# Altium schematic sheet SCH_ESP32_8051_GATE.SchDoc
size 381 x 241 mm; SheetNumber: 1; SheetTotal: 1
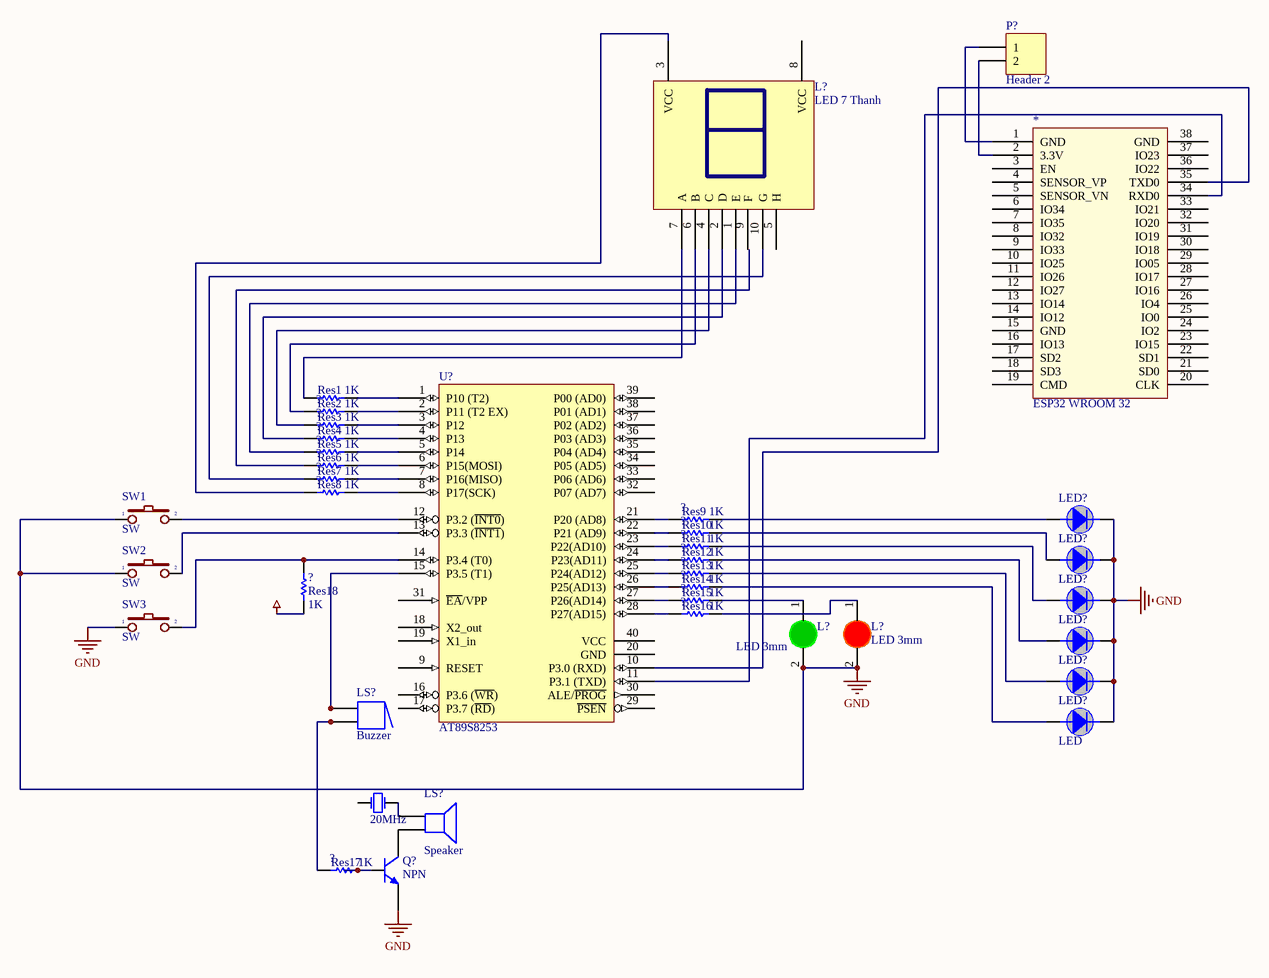
[diagram p0: SCH_ESP32_8051_GATE.SchDoc]

## Parts
(Parts that share a designator on the sheet are numbered #1, #2 ... from top to bottom, then left to right.)
*  ESP32 WROOM 32  [ESP32-WROOM-32D]
?#1  Res1  value 1K  [AXIAL-0.3]
?#2  Res2  value 1K  [AXIAL-0.3]
?#3  Res3  value 1K  [AXIAL-0.3]
?#4  Res4  value 1K  [AXIAL-0.3]
?#5  Res5  value 1K  [AXIAL-0.3]
?#6  Res6  value 1K  [AXIAL-0.3]
?#7  Res7  value 1K  [AXIAL-0.3]
?#8  Res8  value 1K  [AXIAL-0.3]
?#9  Res9  value 1K  [AXIAL-0.3]
?#10  Res10  value 1K  [AXIAL-0.3]
?#11  Res11  value 1K  [AXIAL-0.3]
?#12  Res12  value 1K  [AXIAL-0.3]
?#13  Res13  value 1K  [AXIAL-0.3]
?#14  Res14  value 1K  [AXIAL-0.3]
?#15  Res15  value 1K  [AXIAL-0.3]
?#16  Res18  value 1K  [AXIAL-0.3]
?#17  Res16  value 1K  [AXIAL-0.3]
?#18  Res17  value 1K  [AXIAL-0.3]
L?#1  LED 7 Thanh  [LED 7x1 0.56]
L?#2  LED 3mm  [LED-3MM-GREEN]
L?#3  LED 3mm  [LED-3MM-RED]
LED?#1  LED  [LED_phi 5]
LED?#2  LED  [LED_phi 5]
LED?#3  LED  [LED_phi 5]
LED?#4  LED  [LED_phi 5]
LED?#5  LED  [LED_phi 5]
LED?#6  LED  [LED_phi 5]
LS?#1  Buzzer  [ABSM-1574]
LS?#2  Speaker  [PIN2]
P?  Header 2  [HDR1X2]
Q?  NPN  [TO-226-AA]
SW1  SW  [SW-2P-S]
SW2  SW  [SW-2P-S]
SW3  SW  [SW-2P-S]
U?  AT89S8253  [DIP40_]
Y?  20MHz  [XTAL]

## Nets
GND: L?#2.2(K) L?#3.2(K) LED?#1.2(Katot) LED?#2.2(Katot) LED?#3.2(Katot) LED?#4.2(Katot) LED?#5.2(Katot) LED?#6.2(Katot) Q?.3(E) SW1.1 SW2.1 SW3.1
Net*_1: *.1(GND) P?.1
Net*_2: *.2(3.3V) P?.2
Net*_34: *.34(RXD0) U?.11(P3.1_(TXD))
Net*_35: *.35(TXD0) U?.10(P3.0_(RXD))
Net?#1_1: ?#1.1 L?#1.7(A)
Net?#1_2: ?#1.2 U?.1(P10_(T2))
Net?#2_1: ?#2.1 L?#1.6(B)
Net?#2_2: ?#2.2 U?.2(P11_(T2_EX))
Net?#3_1: ?#3.1 L?#1.4(C)
Net?#3_2: ?#3.2 U?.3(P12)
Net?#4_1: ?#4.1 L?#1.2(D)
Net?#4_2: ?#4.2 U?.4(P13)
Net?#5_1: ?#5.1 L?#1.1(E)
Net?#5_2: ?#5.2 U?.5(P14)
Net?#6_2: ?#6.2 U?.6(P15(MOSI))
Net?#7_1: ?#7.1 L?#1.10(G)
Net?#7_2: ?#7.2 U?.7(P16(MISO))
Net?#8_1: ?#8.1 L?#1.3(VCC)
Net?#8_2: ?#8.2 U?.8(P17(SCK))
Net?#9_1: ?#9.1 U?.21(P20_(AD8))
Net?#9_2: ?#9.2 LED?#1.1(anot)
Net?#10_1: ?#10.1 U?.22(P21_(AD9))
Net?#10_2: ?#10.2 LED?#2.1(anot)
Net?#11_1: ?#11.1 U?.23(P22(AD10))
Net?#11_2: ?#11.2 LED?#3.1(anot)
Net?#12_1: ?#12.1 U?.24(P23(AD11))
Net?#12_2: ?#12.2 LED?#4.1(anot)
Net?#13_1: ?#13.1 U?.25(P24(AD12))
Net?#13_2: ?#13.2 LED?#5.1(anot)
Net?#14_1: ?#14.1 U?.26(P25(AD13))
Net?#14_2: ?#14.2 LED?#6.1(anot)
Net?#15_1: ?#15.1 U?.27(P26(AD14))
Net?#15_2: ?#15.2 L?#2.1(A)
Net?#16_2: ?#16.2 SW3.2 U?.14(P3.4_(T0))
Net?#17_1: ?#17.1 U?.28(P27(AD15))
Net?#17_2: ?#17.2 L?#3.1(A)
Net?#18_1: ?#18.1 LS?#1.2 LS?#1.2A
Net?#18_2: ?#18.2 Q?.2(B)
NetLS?#1_1: LS?#1.1 LS?#1.1A U?.15(P3.5_(T1))
NetLS?#2_1: LS?#2.1 Y?.2(OSC2)
NetLS?#2_2: LS?#2.2 Q?.1(C)
NetSW1_2: SW1.2 U?.12(P3.2_(~{INT0}))
NetSW2_2: SW2.2 U?.13(P3.3_(~{INT1}))

Not connected (* = marked no-connect by the designer): * 3(EN) 4(SENSOR_VP) 5(SENSOR_VN) 6(IO34) 7(IO35) 8(IO32) 9(IO33) 10(IO25) 11(IO26) 12(IO27) 13(IO14) 14(IO12) 15(GND) 16(IO13) 17(SD2) 18(SD3) 19(CMD) 20(CLK) 21(SD0) 22(SD1) 23(IO15) 24(IO2) 25(IO0) 26(IO4) 27(IO16) 28(IO17) 29(IO05) 30(IO18) 31(IO19) 32(IO20) 33(IO21) 36(IO22) 37(IO23) 38(GND); ?#6 1; ?#16 1; L?#1 5(H) 8(VCC) 9(F); U? 9(RESET) 16(P3.6_(~{WR})) 17(P3.7_(~{RD})) 18(X2_out) 19(X1_in) 20(GND) 29(~{PSEN}) 30(ALE/~{PROG}) 31(~{EA}/VPP) 32(P07_(AD7)) 33(P06_(AD6)) 34(P05_(AD5)) 35(P04_(AD4)) 36(P03_(AD3)) 37(P02_(AD2)) 38(P01_(AD1)) 39(P00_(AD0)) 40(VCC); Y? 1(OSC1)

## Library data of the parts
?#1-?#18 = Res1: Resistor; Published: 8-Jun-2000; LatestRevisionDate: 17-Jul-2002; LatestRevisionNote: Re-released for DXP Platform.; PackageReference: AXIAL-0.3; Publisher: Altium Limited; PackageDescription: Axial Device, Thru-Hole; 2 Leads; 0.3 in Pin Spacing
L?#1 = LED 7x1 0.56 Anot: Dán; Don_Vi: Con; Ma_Hang: MH000834; Ten_Linh_Kien: Led 7 0.56 1 Số Anot (Sáng Đỏ); Ghi_Chu: *; Kieu_Chan: *; Chung_Loai: Dán
L?#2 = LED 3mm Xanh La: Cắm; Don_Vi: Con; Ma_Hang: MH001054; Ten_Linh_Kien: Led 3MM Phủ Xanh (10c); Ghi_Chu: *; Kieu_Chan: *; Chung_Loai: Cắm
L?#3 = LED 3mm Do: Cắm; Don_Vi: Con; Ma_Hang: MH003892; Ten_Linh_Kien: Led 3MM Phủ Đỏ (10c); Ghi_Chu: *; Kieu_Chan: *; Chung_Loai: Cắm
LED?#1-LED?#6 = LED_phi 5
LS?#1 = Buzzer: Magnetic Transducer Buzzer; Published: 24-Mar-1999; LatestRevisionDate: 17-Dec-2003; LatestRevisionNote: Schematic revised, PCB Footprint replaced.; DatasheetVersion: 17-Dec-2003; PackageReference: ABSM-1574; Publisher: Altium Limited; PackageDescription: Magnetic Transducer Buzzer; ComponentLink1Description: Manufacturer Link; ComponentLink1URL: http://www.megastar.com/linecard/buzzmode/index.php
LS?#2 = Speaker: Loudspeaker; Published: 24-Mar-1999; LatestRevisionDate: 17-Jul-2002; LatestRevisionNote: Re-released for DXP Platform.; PackageReference: PIN2; Publisher: Altium Limited
P? = Header 2: Header, 2-Pin; LatestRevisionDate: 17-Jul-2002; LatestRevisionNote: Re-released for DXP Platform.; Publisher: Altium Limited
Q? = NPN: NPN Bipolar Transistor; Published: 8-Jun-2000; LatestRevisionDate: 17-Jul-2002; LatestRevisionNote: Re-released for DXP Platform.; PackageReference: TO-226-AA; Publisher: Altium Limited; PackageDescription: TO, Flat Index; 3 In-Line, Axial Leads; Body Dia. 4.8mm; Leads 0.55 x 0.51 mm (max); Code_JEDEC: TO-226-AA
SW1-SW3 = SW2: Switch button 2 pin; Value: SW chip 2 pin
Y? = XTAL_1: Crystal Oscillator; Published: 8-Jun-2000; LatestRevisionDate: 17-Jul-2002; LatestRevisionNote: Re-released for DXP Platform.; PackageReference: R38; Publisher: Altium Limited